# Altium schematic sheet FMC_Conn.SchDoc
size A3; SheetNumber: 3; ProjectName: FMC-5CH-POF
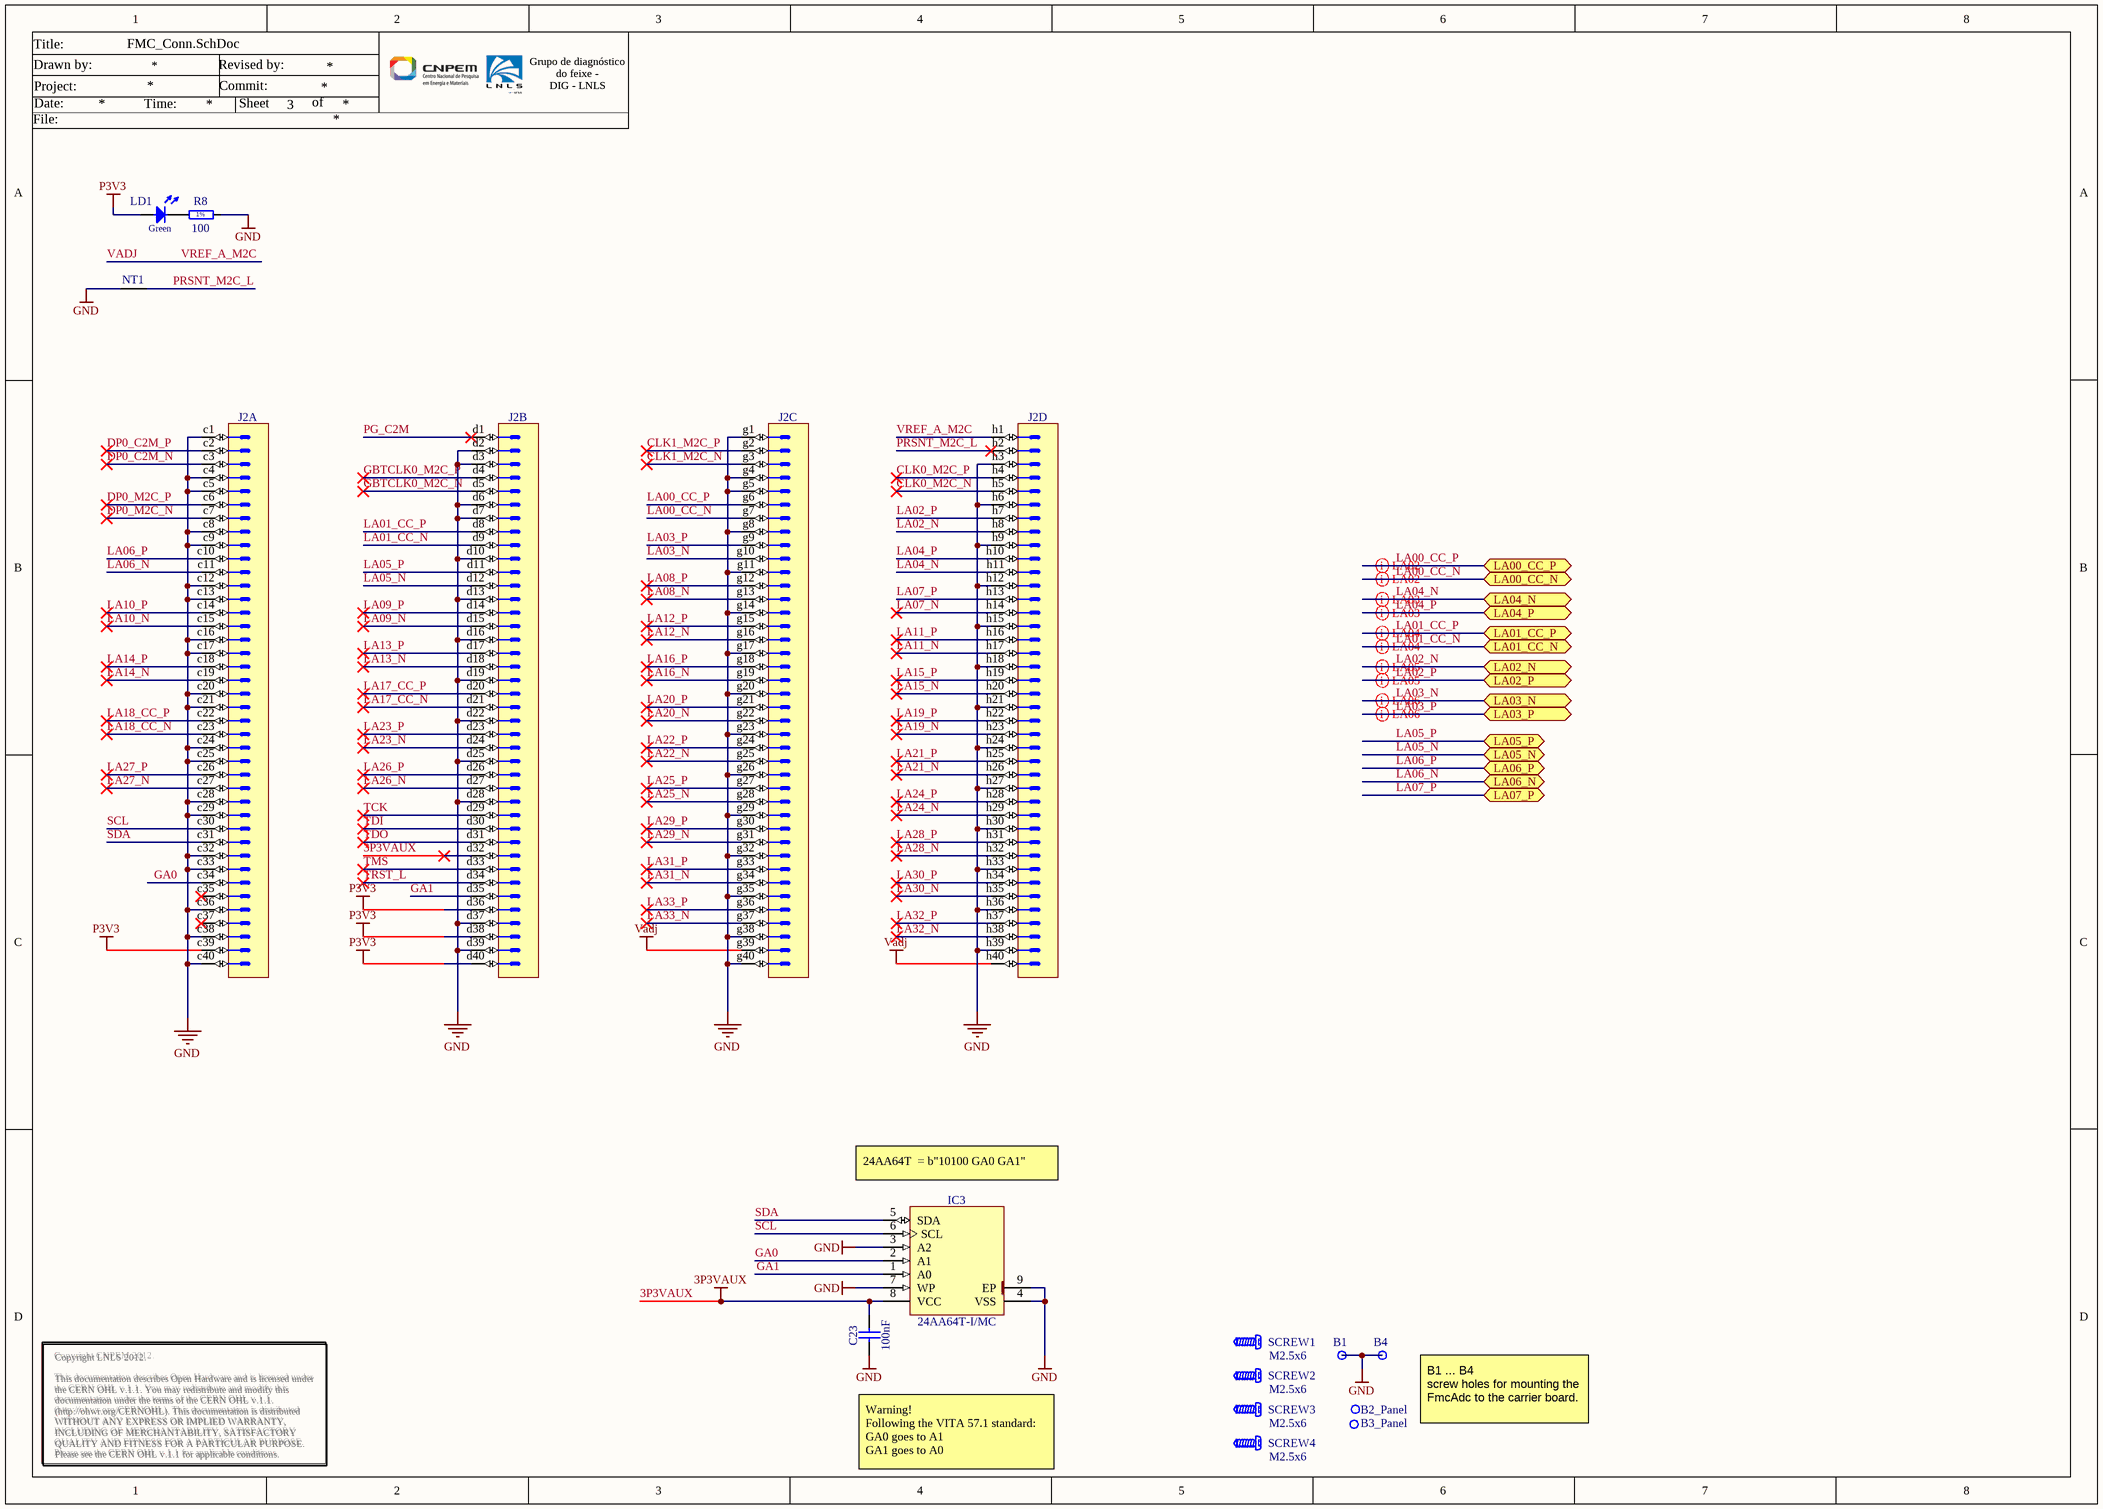
[diagram p0: FMC_Conn.SchDoc]

## Parts
B1  Plated Hole  [MTG270_500_M]  (value not drawn)
B2_Panel  Plated Hole  [MTG270_500_M]  (value not drawn)
B3_Panel  Plated Hole  [MTG270_500_M]  (value not drawn)
B4  Plated Hole  [MTG270_500_M]  (value not drawn)
C23  100nF  [CAPC1005X55N]
IC3  24AA64T-I/MC  [SON50P300X200X100-9N-R175X155]
J2  VITA 57  [SAMTEC_ASP-134606-01]  (value not drawn)  (parts A,B,C,D of 4)
LD1  Green  [LED_OSRAM_LGL29K]  (value not drawn)
NT1  Net Tie  [Net Tie]  (value not drawn)  (net tie, no BOM)
R8  100  [RESC1005X40N]
SCREW1  M2.5x6  [BOSSARD_BN5687-3061597_v]
SCREW2  M2.5x6  [BOSSARD_BN5687-3061597_v]
SCREW3  M2.5x6  [BOSSARD_BN5687-3061597_v]
SCREW4  M2.5x6  [BOSSARD_BN5687-3061597_v]

## Ports
LA00_CC_N, LA00_CC_P, LA01_CC_N, LA01_CC_P, LA02_N, LA02_P, LA03_N, LA03_P, LA04_N, LA04_P, LA05_N, LA05_P, LA06_N, LA06_P, LA07_P

## Nets
3P3VAUX: C23.2 IC3.8(VCC) J2.d32
GND: B1.1 B4.1 C23.1 IC3.3(A2) IC3.4(VSS) IC3.7(WP) IC3.9(EP) J2.c1 J2.c4 J2.c5 J2.c8 J2.c9 J2.c12 J2.c13 J2.c16 J2.c17 J2.c20 J2.c21 J2.c24 J2.c25 J2.c28 J2.c29 J2.c32 J2.c33 J2.c36 J2.c38 J2.c40 J2.d2 J2.d3 J2.d6 J2.d7 J2.d10 J2.d13 J2.d16 J2.d19 J2.d22 J2.d25 J2.d28 J2.d37 J2.d39 J2.g1 J2.g4 J2.g5 J2.g8 J2.g11 J2.g14 J2.g17 J2.g20 J2.g23 J2.g26 J2.g29 J2.g32 J2.g35 J2.g38 J2.g40 J2.h3 J2.h6 J2.h9 J2.h12 J2.h15 J2.h18 J2.h21 J2.h24 J2.h27 J2.h30 J2.h33 J2.h36 J2.h39 NT1.1 R8.2
P3V3: J2.c39 J2.d36 J2.d38 J2.d40 LD1.2(A)
VADJ: J2.g39 J2.h1 J2.h40  [also labelled VREF_A_M2C]
CLK0_M2C_N: J2.h5
CLK0_M2C_P: J2.h4
CLK1_M2C_N: J2.g3
CLK1_M2C_P: J2.g2
DP0_C2M_N: J2.c3
DP0_C2M_P: J2.c2
DP0_M2C_N: J2.c7
DP0_M2C_P: J2.c6
GA0: IC3.2(A1) J2.c34
GA1: IC3.1(A0) J2.d35
GBTCLK0_M2C_N: J2.d5
GBTCLK0_M2C_P: J2.d4
LA00_CC_N: J2.g7 ; port LA00_CC_N
LA00_CC_P: J2.g6 ; port LA00_CC_P
LA01_CC_N: J2.d9 ; port LA01_CC_N
LA01_CC_P: J2.d8 ; port LA01_CC_P
LA02_N: J2.h8 ; port LA02_N
LA02_P: J2.h7 ; port LA02_P
LA03_N: J2.g10 ; port LA03_N
LA03_P: J2.g9 ; port LA03_P
LA04_N: J2.h11 ; port LA04_N
LA04_P: J2.h10 ; port LA04_P
LA05_N: J2.d12 ; port LA05_N
LA05_P: J2.d11 ; port LA05_P
LA06_N: J2.c11 ; port LA06_N
LA06_P: J2.c10 ; port LA06_P
LA07_N: J2.h14
LA07_P: J2.h13 ; port LA07_P
LA08_N: J2.g13
LA08_P: J2.g12
LA09_N: J2.d15
LA09_P: J2.d14
LA10_N: J2.c15
LA10_P: J2.c14
LA11_N: J2.h17
LA11_P: J2.h16
LA12_N: J2.g16
LA12_P: J2.g15
LA13_N: J2.d18
LA13_P: J2.d17
LA14_N: J2.c19
LA14_P: J2.c18
LA15_N: J2.h20
LA15_P: J2.h19
LA16_N: J2.g19
LA16_P: J2.g18
LA17_CC_N: J2.d21
LA17_CC_P: J2.d20
LA18_CC_N: J2.c23
LA18_CC_P: J2.c22
LA19_N: J2.h23
LA19_P: J2.h22
LA20_N: J2.g22
LA20_P: J2.g21
LA21_N: J2.h26
LA21_P: J2.h25
LA22_N: J2.g25
LA22_P: J2.g24
LA23_N: J2.d24
LA23_P: J2.d23
LA24_N: J2.h29
LA24_P: J2.h28
LA25_N: J2.g28
LA25_P: J2.g27
LA26_N: J2.d27
LA26_P: J2.d26
LA27_N: J2.c27
LA27_P: J2.c26
LA28_N: J2.h32
LA28_P: J2.h31
LA29_N: J2.g31
LA29_P: J2.g30
LA30_N: J2.h35
LA30_P: J2.h34
LA31_N: J2.g34
LA31_P: J2.g33
LA32_N: J2.h38
LA32_P: J2.h37
LA33_N: J2.g37
LA33_P: J2.g36
PG_C2M: J2.d1
PRSNT_M2C_L: J2.h2 NT1.2
SCL: IC3.6(SCL) J2.c30
SDA: IC3.5(SDA) J2.c31
TCK: J2.d29
TDI: J2.d30
TDO: J2.d31
TMS: J2.d33
TRST_L: J2.d34
NetLD1_1: LD1.1(C) R8.1

Not connected (* = marked no-connect by the designer): B2_Panel 1; B3_Panel 1; J2 c35* c37*

## Layout directives
differential pair: LA00_CC_N, LA00_CC_P, LA01_CC_N, LA01_CC_P, LA02_N, LA02_P, LA03_N, LA03_P, LA04_N, LA04_P

## Notes on the sheet
- Title:
- Date:
- Project:
- Drawn by:
- Time:
- Commit:
- Revised by:
- Sheet
- of
- Grupo de diagnóstico do feixe -
  DIG - LNLS
- File:
- (near IC3) 24AA64T  = b"10100 GA0 GA1"
- Copyright LNLS 2012.
  This documentation describes Open Hardware and is licensed under the CERN OHL v.1.1. You may redistribute and modify this documentation under the terms of the CERN OHL v.1.1. (http://ohwr.org/CERNOHL). This documentation is distributed WITHOUT ANY EXPRESS OR IMPLIED WARRANTY, INCLUDING OF MERCHANTABILITY, SATISFACTORY QUALITY AND FITNESS FOR A PARTICULAR PURPOSE. Please see the CERN OHL v.1.1 for applicable conditions.
- (near C23) Warning!
  Following the VITA 57.1 standard:
  GA0 goes to A1
  GA1 goes to A0
- (near B4) B1 ... B4
  screw holes for mounting the FmcAdc to the carrier board.
- Copyright CNPEM 2012.
  This documentation describes Open Hardware and is licensed under the CERN OHL v.1.1. You may redistribute and modify this documentation under the terms of the CERN OHL v.1.1. (http://ohwr.org/CERNOHL). This documentation is distributed WITHOUT ANY EXPRESS OR IMPLIED WARRANTY, INCLUDING OF MERCHANTABILITY, SATISFACTORY QUALITY AND FITNESS FOR A PARTICULAR PURPOSE. Please see the CERN OHL v.1.1 for applicable conditions.
- (in symbol R0402_100R_1%_0.0625W_100PPM) 1%

## Library data of the parts
B1 B2_Panel B3_Panel B4 = PLATED_HOLE2.7_PAD5.0_M: Single Terminal Socket; Part Description: Plated Through Hole: Hole Dia.=2.7mm Pad Dia.=5.0mm Middle hole 3mm; Mounted: No; Part Number: PLATED_HOLE2.7_PAD5.0_M; Component Kind: Standard (No BOM); Component Type: Standard (No BOM); Pin Count: 1; Family: Plated Hole; Socket: No; SMD: No; Status: None; ComponentHeight: 0mm; Author: LNLS DIG FCS; CreateDate: 06/06/2016; LatestRevisionDate: 06/06/2016; PackageDescription: Plated Through Hole: Hole Dia.=2.7mm Pad Dia.=5.0mm Middle hole 3mm; Sense: No; HelpURL: Undefined
C23 = CC0402_100NF_16V_10%_X5R: Non-polarised capacitor; Part Description: SMD Multilayer Chip Ceramic Capacitor; Manufacturer: GENERIC; Manufacturer1 Part Number: GRM155R61C104KA88D; Voltage: 16V; TC: X5R; Tolerance: ±10%; Part Number: CC0402_100NF_16V_10%_X5R; Component Kind: Standard; Component Type: Standard; Pin Count: 2; Value: 100nF; Status: None; Manufacturer Part Number: CC0402_100NF_16V_10%_X5R; Case: 0402; Mounted: Yes; Socket: No; SMD: Yes; Manufacturer1 Example: MURATA; Manufacturer1 ComponentHeight: 0.55mm; HelpURL: \\cern.ch\dfs\Applications\Altium\Datasheets\CC0402_X5R_MURATA_GRM.pdf; Author: CERN DEM JLC; CreateDate: 10/12/2013; LatestRevisionDate: 10/12/2013; Sense: No
IC3 = 24AA64T-I/MC: 1.7-5.5V 64K I2C Serial EEPROM; Part Description: 1.7V-5.5V, 64K  (8K x 8-bit) I2C Serial EEPROM; Manufacturer: MICROCHIP TECHNOLOGY; Bonding: No; PressFit: No; Part Number: 24AA64T-I/MC; Component Kind: Standard; Component Type: Standard; Device: 24AA64T-I/MC; PackageDescription: SON (DFN), 0.50mm pitch, 8 pin, 2mm X 3mm X 1.00mm H body (w/thermal tab 1.75 X 1.55mm),  IPC Medium Density; Manufacturer Part Number: 24AA64T-I/MC; Pin Count: 9; Case: DFN8; Mounted: Yes; Socket: No; SMD: Yes; ComponentHeight: 1mm; HelpURL: \\cern.ch\dfs\Applications\Altium\Datasheets\24AA64T-I-MC.pdf; Author: CERN DEM JLC; CreateDate: 18/11/2009; LatestRevisionDate: 24/01/2011; Sense: No
J2 = SAMTEC_ASP-134606-01: Connector VITA 57, 160 Male contacts in 4 row cdgh; Part Description: 160 contacts (4 rows cdgh) Surface Mount Male Connector, VITA 57 (MC-LPC-10); Manufacturer: SAMTEC; PressFit: No; Part Number: SAMTEC_ASP-134606-01; Component Kind: Standard; Component Type: Standard; Pin Count: 160; Family: VITA 57; Mounted: Yes; Socket: No; Sense: No; SMD: Yes; Status: None; Manufacturer Part Number: ASP-134606-01; ComponentHeight: 5.61mm; Author: LNLS DIG LOS; CreateDate: 30/06/2017; LatestRevisionDate: 30/06/2017
LD1 = LED_OSRAM_LG L29K-G2J1-24-Z: LED Green 1C 2A; Part Description: Surface Mount Green LED (0603 Case); Manufacturer: OSRAM; PressFit: No; Bonding: No; Part Number: LED_OSRAM_LG L29K-G2J1-24-Z; Component Kind: Standard; Component Type: Standard; Color: Green; PackageDescription: Green Chip LED, 2-Leads, Body 1.7x0.8mm, IPC Medium Density; Manufacturer Part Number: LG L29K-G2J1-24-Z; Pin Count: 2; Case: 0603; Mounted: Yes; Socket: No; SMD: Yes; Sense: No; ComponentHeight: 0.67mm; HelpURL: \\cern.ch\dfs\Applications\Altium\Datasheets\LED_OSRAM_LGL29K.pdf; Author: CERN DEM JLC; CreateDate: 24/04/2012; LatestRevisionDate: 24/04/2012
NT1 = Net Tie: Part Description: Net Tie (2 Nets); Mounted: No; Part Number: Net Tie; Component Type: Net Tie; Pin Count: 2; Family: Net Tie; Socket: No; SMD: No; Sense: No; Status: None; ComponentHeight: 0mm; HelpURL: Undefined; Author: CERN DEM JLC; CreateDate: 22/03/2011; LatestRevisionDate: 22/03/2011; PackageDescription: 2 Plated Through Hole For Coaxial Cable Link: Hole Dia.=1.4mm Pad Dia.=2.5mm
R8 = R0402_100R_1%_0.0625W_100PPM: Resistor - 1%; Part Description: General Purpose Thick Film Chip Resistor; Manufacturer: GENERIC; Manufacturer1 Part Number: 232270671001L; TC: ±100ppm/°C; Part Number: R0402_100R_1%_0.0625W_100PPM; Component Kind: Standard; Component Type: Standard; Pin Count: 2; Value: 100; Status: Not recommended; Power: 0.0625W; Tolerance: ±1%; Manufacturer Part Number: R0402_100R_1%_0.0625W_100PPM; Case: 0402; Mounted: Yes; Sense: No; Socket: No; SMD: Yes; Manufacturer1 Example: YAGEO PHYCOMP; Manufacturer1 ComponentHeight: 0.4mm; HelpURL: \\cern.ch\dfs\Applications\Altium\Datasheets\R0402_Phycomp_RC0402.pdf; Author: CERN DEM JLC; CreateDate: 03/12/2007; LatestRevisionDate: 17/10/2012
SCREW1-SCREW4 = BOSSARD_BN5687-3061597_v: Screw; Part Description: M2.5 L=6mm Hexalobular Socket Pan Head Screw, Fully Threaded, Stainless Steel A2; Manufacturer Part Number: BN5687 Art.3061597; PressFit: No; Part Number: BOSSARD_BN5687-3061597_v; Component Kind: Standard; Component Type: Mechanical; Pin Count: 0; PackageDescription: M2.5 L=6mm Hexalobular Socket Pan Head Screw, Fully Threaded - Stainless Steel A2; Mounted: Yes; Socket: No; SMD: No; Sense: No; Status: None; Value: M2.5x6; Manufacturer: BOSSARD; ComponentHeight: 2.1mm; HelpURL: \\cern.ch\dfs\Applications\Altium\Datasheets\BOSSARD_BN5687-3061597.pdf; Author: CERN DEM JLC; CreateDate: 30/05/2013; LatestRevisionDate: 30/05/2013